# EAGLE design ENCODER (EAGLE 9.5.1)
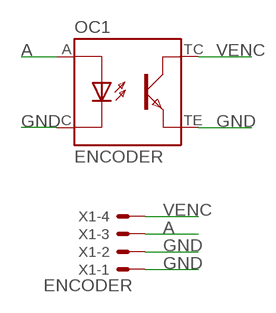
[diagram p0: schematic, sheet 1]

## Parts
OC1  ENCODER  PC-GP1S53V  [PI_GP1S53VJ000F]
X1  ENCODER  22-05-7048-04  [7395-04]

## Nets
A: OC1.A X1.3
GND: OC1.C OC1.TE X1.1 X1.2
VENC: OC1.TC X1.4

## Library data of the parts
OC1 = we-opto:PC: Photocoupler / Photointerrupter TLP127 compatible with TLP187 and LTV-352T
X1 = con-molex:22-?-04: CONNECTOR wire to board 2.54 mm (.1 inch) pitch header; MF: MOLEX; OC_FARNELL: unknown; OC_NEWARK: unknown

## Board
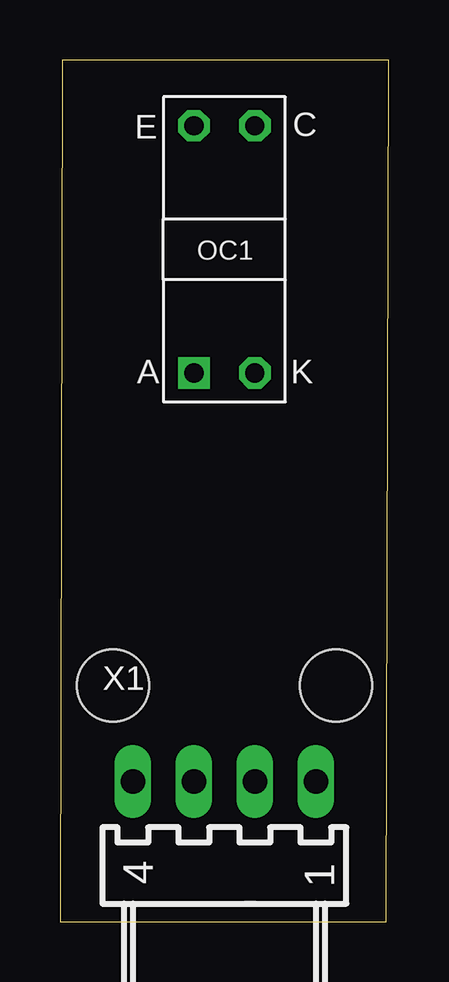
[diagram p1: board, top side]
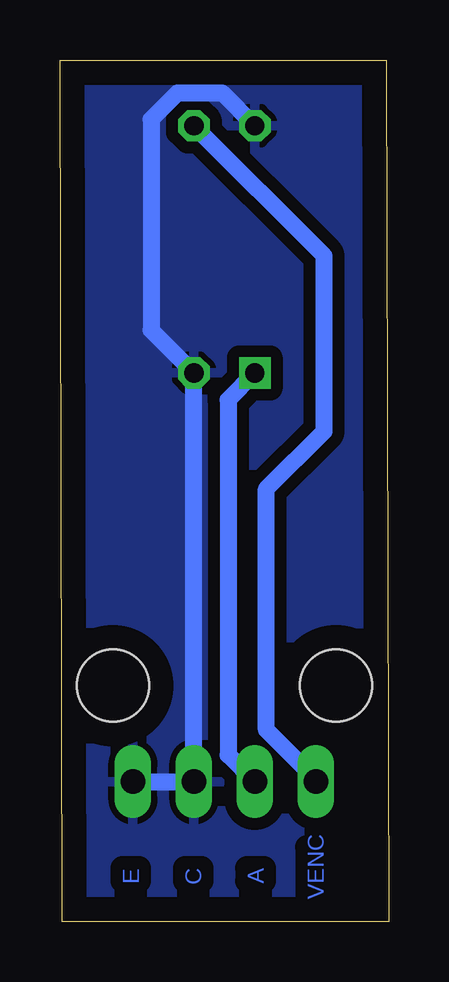
[diagram p2: board, bottom side, seen from below]

Size 13.7 x 35.9 mm. Coordinates in mm from the lower left corner, seen from the top.
Outline: 0,0 13.6,0 13.7,35.9 0.1,35.9 0,0
Copper layers (1*16): Top 0.035mm / dielectric 1.5mm / Bottom 0.035mm
Design rules "default": minimum track width 6mil, minimum drill 0.35mm, track to track 6mil, track to pad 6mil, pad to pad 6mil, via to via 6mil, smd to smd 6mil, copper to edge 40mil, drill to drill 6mil, minimum pad ring 10mil, minimum via ring 8mil, stop-mask expansion 4mil, vias tented up to drill 0mil, thermal gap 10mil
Holes 3 mm at 2.2,9.83 11.5,9.83

### Footprints (pad centres in the part's own frame; a part is rotated, then mirrored left to right if it is on the bottom)
PI_GP1S53VJ000F = drill 0.8 square: A 1.27,5.15 | drill 0.8 octagon: C -1.27,5.15; TC -1.27,-5.15; TE 1.27,-5.15
7395-04 = drill 1.016 long: 1 3.81,0; 2 1.27,0; 3 -1.27,0; 4 -3.81,0

### Placement (x,y rotation side)
OC1  6.85,28.01 180 top
X1  6.85,5.83 0 top

### Tracks (layer width: path | path; a pad name or v marks a point on that pad's centre or on a via)
A
  Bottom 0.7: X1.3 6.7,6.95 6.7,21.74 OC1.A
GND
  Bottom 0.7: X1.1 X1.2 OC1.C 9.9,24.64 9.9,33.43 8.8,34.53 6.95,34.53 OC1.TE
  pour Bottom (isolate 0.5): -0.9,36.53 14.8,36.53 14.8,-1.47 -0.9,-1.47
VENC
  Bottom 0.7: X1.4 3.04,5.93 5.1,7.99 5.1,18.03 2.7,20.43 2.7,27.74 OC1.TC

### Text on the board
Bottom: A | C | E | VENC
tPlace: E | C | A | K